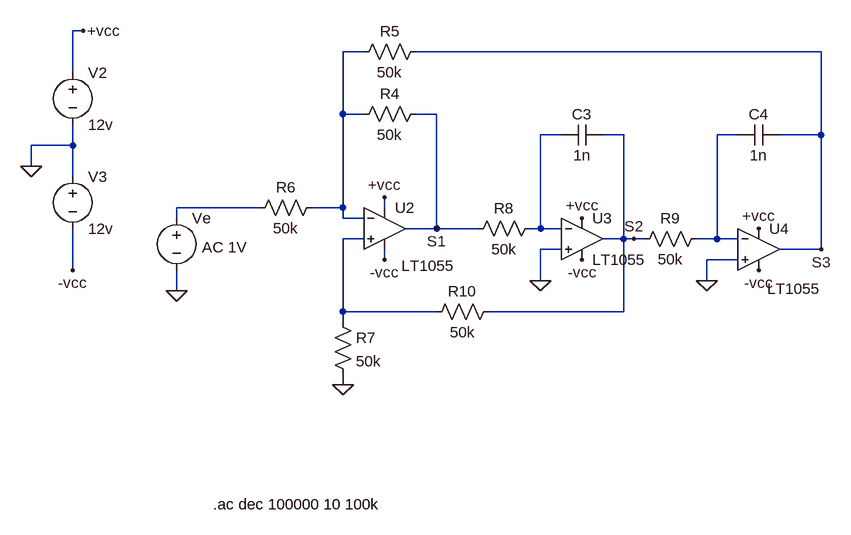
[diagram p0: schematic filtre-exo7.asc]
filtre-exo7.asc, the LTspice schematic file:
Version 4
SHEET 1 988 756
WIRE -208 -80 -224 -80
WIRE 224 -48 192 -48
WIRE 928 -48 304 -48
WIRE -224 -16 -224 -80
WIRE 192 48 192 -48
WIRE 224 48 192 48
WIRE 336 48 304 48
WIRE 528 80 496 80
WIRE 624 80 592 80
WIRE 800 80 768 80
WIRE 928 80 928 -48
WIRE 928 80 864 80
WIRE -224 96 -224 64
WIRE -224 96 -288 96
WIRE -288 128 -288 96
WIRE -224 144 -224 96
WIRE 64 192 -64 192
WIRE 192 192 192 48
WIRE 192 192 144 192
WIRE 256 192 256 176
WIRE -64 208 -64 192
WIRE 192 208 192 192
WIRE 224 208 192 208
WIRE 336 224 336 48
WIRE 336 224 288 224
WIRE 400 224 336 224
WIRE 496 224 496 80
WIRE 496 224 480 224
WIRE 528 224 496 224
WIRE 224 240 192 240
WIRE 624 240 624 80
WIRE 624 240 592 240
WIRE 640 240 624 240
WIRE 656 240 640 240
WIRE 768 240 768 80
WIRE 768 240 736 240
WIRE 800 240 768 240
WIRE 528 256 496 256
WIRE 928 256 928 80
WIRE 928 256 864 256
WIRE 256 272 256 256
WIRE 800 272 752 272
WIRE -224 288 -224 224
WIRE 496 304 496 256
WIRE 752 304 752 272
WIRE -64 320 -64 288
WIRE 192 352 192 240
WIRE 336 352 192 352
WIRE 624 352 624 240
WIRE 624 352 416 352
WIRE 192 368 192 352
WIRE 192 464 192 448
FLAG -64 320 0
FLAG -288 128 0
FLAG -208 -80 +vcc
FLAG -224 288 -vcc
FLAG 256 176 +vcc
FLAG 256 272 -vcc
FLAG 192 464 0
FLAG 336 224 S1
FLAG 560 208 +vcc
FLAG 560 272 -vcc
FLAG 832 224 +vcc
FLAG 832 288 -vcc
FLAG 496 304 0
FLAG 752 304 0
FLAG 640 240 S2
FLAG 928 256 S3
SYMBOL voltage -224 -32 R0
SYMATTR InstName V2
SYMATTR Value 12v
SYMBOL voltage -224 128 R0
SYMATTR InstName V3
SYMATTR Value 12v
SYMBOL LT1055 256 160 R0
WINDOW 3 26 121 Left 2
SYMATTR InstName U2
SYMBOL res 320 32 R90
WINDOW 0 0 56 VBottom 2
WINDOW 3 32 56 VTop 2
SYMATTR InstName R4
SYMATTR Value 50k
SYMBOL res 320 -64 R90
WINDOW 0 0 56 VBottom 2
WINDOW 3 32 56 VTop 2
SYMATTR InstName R5
SYMATTR Value 50k
SYMBOL res 160 176 R90
WINDOW 0 0 56 VBottom 2
WINDOW 3 32 56 VTop 2
SYMATTR InstName R6
SYMATTR Value 50k
SYMBOL res 176 352 R0
SYMATTR InstName R7
SYMATTR Value 50k
SYMBOL LT1055 560 176 R0
SYMATTR InstName U3
SYMBOL LT1055 832 192 R0
WINDOW 3 13 125 Left 2
SYMATTR InstName U4
SYMBOL res 496 208 R90
WINDOW 0 0 56 VBottom 2
WINDOW 3 32 56 VTop 2
SYMATTR InstName R8
SYMATTR Value 50k
SYMBOL res 752 224 R90
WINDOW 0 0 56 VBottom 2
WINDOW 3 32 56 VTop 2
SYMATTR InstName R9
SYMATTR Value 50k
SYMBOL cap 592 64 R90
WINDOW 0 0 32 VBottom 2
WINDOW 3 32 32 VTop 2
SYMATTR InstName C3
SYMATTR Value 1n
SYMBOL cap 864 64 R90
WINDOW 0 0 32 VBottom 2
WINDOW 3 32 32 VTop 2
SYMATTR InstName C4
SYMATTR Value 1n
SYMBOL res 432 336 R90
WINDOW 0 0 56 VBottom 2
WINDOW 3 32 56 VTop 2
SYMATTR InstName R10
SYMATTR Value 50k
SYMBOL voltage -64 192 R0
WINDOW 123 39 61 Left 2
WINDOW 39 0 0 Left 0
SYMATTR Value2 AC 1V
SYMATTR InstName Ve
SYMATTR Value ""
TEXT -8 648 Left 2 !.ac dec 100000 10 100k

The netlist it stands for:
* filtre-exo7.asc
V2 +vcc 0 12v
V3 0 -vcc 12v
* U2: LT1055 (symbol LT1055 not available, pins judged from their places): In+=N005 In-=N001 V+=+vcc V-=-vcc OUT=S1
R4 S1 N001 50k
R5 S3 N001 50k
R6 N001 N004 50k
R7 N005 0 50k
* U3: LT1055 (symbol LT1055 not available, pins judged from their places): In+=0 In-=N002 V+=+vcc V-=-vcc OUT=S2
* U4: LT1055 (symbol LT1055 not available, pins judged from their places): In+=0 In-=N003 V+=+vcc V-=-vcc OUT=S3
R8 N002 S1 50k
R9 N003 S2 50k
C3 S2 N002 1n
C4 S3 N003 1n
R10 S2 N005 50k
Ve N004 0 AC 1V
.ac dec 100000 10 100k
.backanno
.end